# Altium schematic sheet Microcontroller.SchDoc: Microcontroller
size Letter; Date: 2017-02-04; DocumentNumber: 10; Revision: A; SheetNumber: 10; SheetTotal: 16; DesignedBy: Craig Comberbach
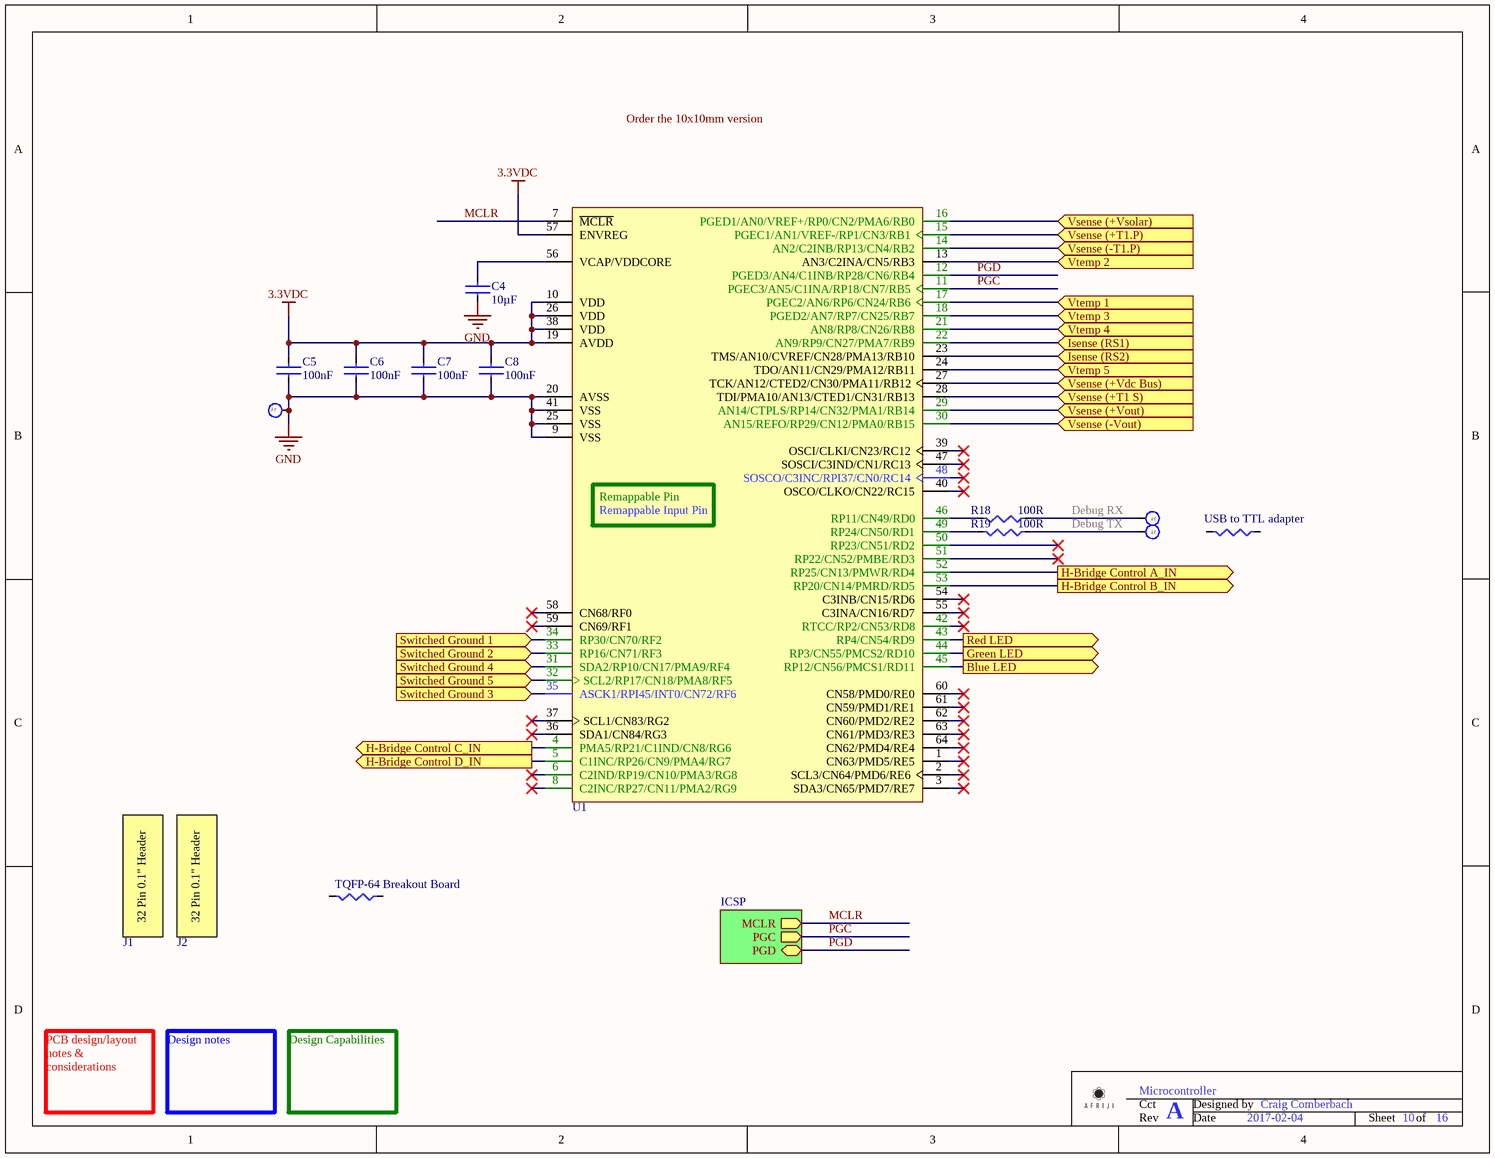
[diagram p0: Microcontroller.SchDoc]

## Parts
C4  Capacitance: 10µF  [C0805 - Ceramic]  (hidden comment: 10uF 0805 10V)
C5  Capacitance: 100nF  [C0603 - Ceramic]  (hidden comment: 100nF 0603 50V)
C6  Capacitance: 100nF  [C0603 - Ceramic]  (hidden comment: 100nF 0603 50V)
C7  Capacitance: 100nF  [C0603 - Ceramic]  (hidden comment: 100nF 0603 50V)
C8  Capacitance: 100nF  [C0603 - Ceramic]  (hidden comment: 100nF 0603 50V)
J1  32-Pin 0.1" Header  (value not drawn)  (mechanical)
J2  32-Pin 0.1" Header  (value not drawn)  (mechanical)
R18  Resistance (Ohms): 100R  [R0603]  (hidden comment: 100R 0603 1%)
R19  Resistance (Ohms): 100R  [R0603]  (hidden comment: 100R 0603 1%)
TP1  Test Clip  [SMT Test Clip]  (value not drawn)
TP2  Test Clip  [SMT Test Clip]  (value not drawn)
TP3  Test Clip  [SMT Test Clip]  (value not drawn)
TQFP-64_Breakout_Board  1k 1210 1%  (value not drawn)  (mechanical)
U1  PIC24FJ256GA106 Microprocessor  [TQFP-64 0.5mm Breakout Board]  (value not drawn)
USB_to_TTL_Serial_3.3V  USB to TTL adapter  (mechanical)

## Sub-sheets
ICSP = ICSP.SchDoc: MCLR (out), PGD (bidir), PGC (out)

## Ports
Blue LED (out), Green LED (out), H-Bridge Control A_IN (out), H-Bridge Control B_IN (out), H-Bridge Control C_IN (out), H-Bridge Control D_IN (out), Isense (RS1) (in), Isense (RS2) (in), Red LED (out), Switched Ground 1 (in), Switched Ground 2 (in), Switched Ground 3 (in), Switched Ground 4 (in), Switched Ground 5 (in), Vsense (+T1 S) (in), Vsense (+T1.P) (in), Vsense (+Vdc Bus) (in), Vsense (+Vout) (in), Vsense (+Vsolar) (in), Vsense (-T1.P) (in), Vsense (-Vout) (in), Vtemp 1 (in), Vtemp 2 (in), Vtemp 3 (in), Vtemp 4 (in), Vtemp 5 (in)

## Nets
3.3VDC: C5.1 C6.1 C7.1 C8.1 U1.10(VDD) U1.19(AVDD) U1.26(VDD) U1.38(VDD) U1.57(ENVREG)
GND: C4.2 C5.2 C6.2 C7.2 C8.2 TP1.1 U1.9(VSS) U1.20(AVSS) U1.25(VSS) U1.41(VSS)
Blue LED: U1.45(RP12/CN56/PMCS1/RD11) ; port Blue LED
Debug RX: R18.2 TP2.1
Debug TX: R19.2 TP3.1
Green LED: U1.44(RP3/CN55/PMCS2/RD10) ; port Green LED
H-Bridge Control A_IN: U1.52(RP25/CN13/PMWR/RD4) ; port H-Bridge Control A_IN
H-Bridge Control B_IN: U1.53(RP20/CN14/PMRD/RD5) ; port H-Bridge Control B_IN
H-Bridge Control C_IN: U1.4(PMA5/RP21/C1IND/CN8/RG6) ; port H-Bridge Control C_IN
H-Bridge Control D_IN: U1.5(C1INC/RP26/CN9/PMA4/RG7) ; port H-Bridge Control D_IN
Isense (RS1): U1.22(AN9/RP9/CN27/PMA7/RB9) ; port Isense (RS1)
Isense (RS2): U1.23(TMS/AN10/CVREF/CN28/PMA13/RB10) ; port Isense (RS2)
MCLR: U1.7(~{MCLR}) ; sheet ICSP/MCLR
PGC: U1.11(PGEC3/AN5/C1INA/RP18/CN7/RB5) ; sheet ICSP/PGC
PGD: U1.12(PGED3/AN4/C1INB/RP28/CN6/RB4) ; sheet ICSP/PGD
Red LED: U1.43(RP4/CN54/RD9) ; port Red LED
Switched Ground 1: U1.34(RP30/CN70/RF2) ; port Switched Ground 1
Switched Ground 2: U1.33(RP16/CN71/RF3) ; port Switched Ground 2
Switched Ground 3: U1.35(ASCK1/RPI45/INT0/CN72/RF6) ; port Switched Ground 3
Switched Ground 4: U1.31(SDA2/RP10/CN17/PMA9/RF4) ; port Switched Ground 4
Switched Ground 5: U1.32(SCL2/RP17/CN18/PMA8/RF5) ; port Switched Ground 5
Vsense (+T1 S): U1.28(TDI/PMA10/AN13/CTED1/CN31/RB13) ; port Vsense (+T1 S)
Vsense (+T1.P): U1.15(PGEC1/AN1/VREF-/RP1/CN3/RB1) ; port Vsense (+T1.P)
Vsense (+Vdc Bus): U1.27(TCK/AN12/CTED2/CN30/PMA11/RB12) ; port Vsense (+Vdc Bus)
Vsense (+Vout): U1.29(AN14/CTPLS/RP14/CN32/PMA1/RB14) ; port Vsense (+Vout)
Vsense (+Vsolar): U1.16(PGED1/AN0/VREF+/RP0/CN2/PMA6/RB0) ; port Vsense (+Vsolar)
Vsense (-T1.P): U1.14(AN2/C2INB/RP13/CN4/RB2) ; port Vsense (-T1.P)
Vsense (-Vout): U1.30(AN15/REFO/RP29/CN12/PMA0/RB15) ; port Vsense (-Vout)
Vtemp 1: U1.17(PGEC2/AN6/RP6/CN24/RB6) ; port Vtemp 1
Vtemp 2: U1.13(AN3/C2INA/CN5/RB3) ; port Vtemp 2
Vtemp 3: U1.18(PGED2/AN7/RP7/CN25/RB7) ; port Vtemp 3
Vtemp 4: U1.21(AN8/RP8/CN26/RB8) ; port Vtemp 4
Vtemp 5: U1.24(TDO/AN11/CN29/PMA12/RB11) ; port Vtemp 5
NetC4_1: C4.1 U1.56(VCAP/VDDCORE)
NetR18_1: R18.1 U1.46(RP11/CN49/RD0)
NetR19_1: R19.1 U1.49(RP24/CN50/RD1)

Not connected (* = marked no-connect by the designer): TQFP-64_Breakout_Board 1 2; U1 1(CN63/PMD5/RE5)* 2(SCL3/CN64/PMD6/RE6)* 3(SDA3/CN65/PMD7/RE7)* 6(C2IND/RP19/CN10/PMA3/RG8)* 8(C2INC/RP27/CN11/PMA2/RG9)* 36(SDA1/CN84/RG3)* 37(SCL1/CN83/RG2)* 39(OSCI/CLKI/CN23/RC12)* 40(OSCO/CLKO/CN22/RC15)* 42(RTCC/RP2/CN53/RD8)* 47(SOSCI/C3IND/CN1/RC13)* 48(SOSCO/C3INC/RPI37/CN0/RC14)* 50(RP23/CN51/RD2)* 51(RP22/CN52/PMBE/RD3)* 54(C3INB/CN15/RD6)* 55(C3INA/CN16/RD7)* 58(CN68/RF0)* 59(CN69/RF1)* 60(CN58/PMD0/RE0)* 61(CN59/PMD1/RE1)* 62(CN60/PMD2/RE2)* 63(CN61/PMD3/RE3)* 64(CN62/PMD4/RE4)*; USB_to_TTL_Serial_3.3V 1 2

## Notes on the sheet
- PCB design/layout notes & considerations
- Design notes
- Design Capabilities
- Cct
- Designed by
- Rev
- Date
- Sheet
- of
- Labels drawn without touching a wire or pin: Order the 10x10mm version
- (in symbol 32-Pin 0.1" Header) 32 Pin 0.1" Header
- (in symbol PIC24FJ256GA106 Microprocessor) Remappable Pin; Remappable Input Pin
- (in symbol Test Clip) Clip; Test

## Library data of the parts
C4 = 10uF 0805 10V: Manufacturer: Kemet; Manufacturer Part Number: C0805C106K8PACTU; Tolerance: ±10%; Temperature Coefficient: X5R; Value: 10uF 0805 10V; Supplier 1: Digi-Key; RoHS: RoHS Compliant; Category: Capacitors; Stock 1: 215894; Pricing 1: 1=0.21, 10=0.14, 50=0.085, 100=0.0714, 250=0.0578, 500=0.051, 1000=0.04335 (USD); Packaging: Cut Tape (CT); Voltage - Rated: 10V; Mounting Type: Surface Mount, MLCC; Operating Temperature: -55°C ~ 85°C; Applications: General Purpose; Ratings: -; Package / Case: 0805 (2012 Metric); Size / Dimension: 0.079" L x 0.049" W (2.00mm x 1.25mm); Height - Seated (Max): -; Thickness (Max): 0.055" (1.40mm); Lead Spacing: -; Features: -; Lead Style: -; ComponentLink1URL: http://www.kemet.com/docfinder?Partnumber=C0805C106K8PACTU; ComponentLink1Description: Spec Sheet; Supplier Part Number 1: 399-4925-1-ND
C5-C8 = 100nF 0603 50V: Manufacturer: Samsung Electro-Mechanics America, Inc; Manufacturer Part Number: CL10B104KB8SFNC; Tolerance: ±10%; Temperature Coefficient: X7R; Value: 100nF 0603 50V; Supplier 1: Digi-Key; RoHS: RoHS Compliant; Category: Capacitors; Stock 1: 1192070; Pricing 1: 1=0.1, 10=0.027, 25=0.0192, 100=0.0125, 500=0.00874, 1000=0.00681 (USD); Packaging: Cut Tape (CT); Voltage - Rated: 50V; Mounting Type: Surface Mount, MLCC; Operating Temperature: -55°C ~ 125°C; Applications: Boardflex Sensitive; Ratings: -; Package / Case: 0603 (1608 Metric); Size / Dimension: 0.063" L x 0.031" W (1.60mm x 0.80mm); Height - Seated (Max): -; Thickness (Max): 0.035" (0.90mm); Lead Spacing: -; Features: Soft Termination; Lead Style: -; ComponentLink1URL: http://www.samsungsem.com/kr/front/downloadcms.do?path=/kr/support/product-search/mlcc/__icsFiles/afieldfile/2014/11/05&fileName=S_CL10B104KB8SFNC.pdf; ComponentLink1Description: Spec Sheet; Supplier Part Number 1: 1276-1936-1-ND
J1 J2 = 32-Pin 0.1" Header: Manufacturer: Wurth Electronics Inc; Manufacturer Part Number: 61303211821; Style: Board to Board; Number of Positions: 32; Number of Positions Loaded: All; Pitch - Mating: 0.100" (2.54mm); Contact Length - Post: 0.122" (3.10mm); Material Flammability Rating: UL94 V-0; Current Rating: 3A; Voltage Rating: 250VAC; Supplier 1: Digi-Key; RoHS: RoHS Compliant; Category: Connectors, Interconnects; Stock 1: 332; Pricing 1: 1=1.86, 10=1.788, 50=1.65, 100=1.5125, 500=1.375 (USD); Packaging: Tray; Part Status: Active; Connector Type: Header; Contact Type: Forked; Number of Rows: 1; Row Spacing - Mating: -; Mounting Type: Through Hole; Termination: Solder; Fastening Type: Push-Pull; Contact Finish - Mating: Gold; Contact Finish Thickness - Mating: -; Insulation Color: Black; Insulation Height: 0.335" (8.51mm); Operating Temperature: -40°C ~ 105°C; Contact Finish - Post: Gold; Mated Stacking Heights: -; Ingress Protection: -; Features: -; Applications: -; Insulation Material: Polybutylene Terephthalate (PBT); Contact Shape: Square; Contact Material: Copper Alloy; Contact Finish Thickness - Post: -; ComponentLink1URL: http://katalog.we-online.de/em/datasheet/6130xx11821.pdf; ComponentLink1Description: Spec Sheet; Supplier Part Number 1: 732-2860-ND
R18 R19 = 100R 0603 1%: 1/8W; Manufacturer: Yageo; Manufacturer Part Number: RC0603FR-07100RL; Power (Watts): 0.1W, 1/10W; Temperature Coefficient: ±100ppm/°C; Value: 100R 0603 1%; Supplier 1: Digi-Key; RoHS: RoHS Compliant; Category: Resistors; Stock 1: 2116183; Pricing 1: 1=0.1, 10=0.015, 25=0.0108, 100=0.006, 250=0.00456, 500=0.00364, 1000=0.00268, 2500=0.00233 (USD); Packaging: Cut Tape (CT); Tolerance: ±1%; Composition: Thick Film; Features: Moisture Resistant; Operating Temperature: -55°C ~ 155°C; Package / Case: 0603 (1608 Metric); Supplier Device Package: 0603; Size / Dimension: 0.063" L x 0.031" W (1.60mm x 0.80mm); Height: 0.022" (0.55mm); Number of Terminations: 2; ComponentLink1URL: http://www.yageo.com/NewPortal/yageodocoutput?fileName=/pdf/R-Chip/PYu-RC_Group_51_RoHS_L_0.pdf; ComponentLink1Description: http://www.yageo.com/NewPortal/yageodocoutput?fileName=/pdf/R-Chip/PYu-RC_Group_51_RoHS_L_0.pdf; Supplier Part Number 1: 311-100HRCT-ND
TP1-TP3 = Test Clip: Manufacturer: TE Connectivity AMP Connectors; Manufacturer Part Number: RCU-0C; Value: SMT Test Clip; Material - Insulation: No Insulation; Technology: SMT; Supplier 1: Digi-Key; RoHS: RoHS Compliant; Category: Test and Measurement; Stock 1: 58926; Pricing 1: 1=0.31, 10=0.291, 25=0.248, 50=0.217, 100=0.2014, 250=0.1782, 500=0.17046, 1000=0.13947 (CAD); Packaging: Cut Tape (CT); Part Status: Active; Type: PC Test Point; Mounting Type: Surface Mount; Color: Natural; Size / Dimension: 0.063" x 0.031" x 0.045" (1.60mm x 0.80mm x 1.15mm); Plating: -; Material - Body: -; ComponentLink1URL: http://www.te.com/commerce/DocumentDelivery/DDEController?Action=srchrtrv&DocNm=1773266&DocType=DS&DocLang=English; ComponentLink1Description: Spec Sheet; Supplier Part Number 1: A106145CT-ND
TQFP-64_Breakout_Board = 1k 1210 1%: 1/8W; Manufacturer: Chip Quik Inc.; Manufacturer Part Number: PA0096; Value: TQFP-64 Breakout Board; Proto Board Type: SMD to DIP; Package Accepted: LQFP, TQFP, VQFP; Number of Positions: 64; Pitch: 0.020" (0.50mm); Board Thickness: 0.062" (1.57mm) 1/16"; Supplier 1: Digi-Key; Supplier Part Number 1: PA0096-ND; RoHS: RoHS Compliant; Category: Prototyping Products; Stock 1: 56; Pricing 1: 1=15.79 (USD); Part Status: Active; Hole Diameter: -; Material: FR4 Epoxy Glass; Size / Dimension: 1.000" x 3.200" (25.40mm x 81.28mm); ComponentLink1URL: http://www.chipquik.com/datasheets/PA0096.pdf; ComponentLink1Description: Spec Sheet
U1 = PIC24FJ256GA106 Microprocessor: General Purpose 16-Bit Flash Microcontroller, 256KB Flash, 16KB SRAM, 64-Pin TQFP, Industrial Temperature; Manufacturer: Microchip Technology; Manufacturer Part Number: PIC24FJ256GA106-I/PT; Core Processor: PIC; Speed: 32MHz; Connectivity: I²C, PMP, SPI, UART/USART; Peripherals: Brown-out Detect/Reset, LVD, POR, PWM, WDT; Number of I/O: 53; Program Memory Size: 256KB (85.5K x 24); RAM Size: 16K x 8; Voltage - Supply (Vcc/Vdd): 2 V ~ 3.6 V; Data Converters: A/D 16x10b; Oscillator Type: Internal; Value: PIC24FJ256GA106 Microprocessor; Technology: SMT; Supplier 1: Digi-Key; Supplier Part Number 1: PIC24FJ256GA106-I/PT-ND; RoHS: RoHS Compliant; Category: Integrated Circuits (ICs); Stock 1: 6379; Pricing 1: 1=7.45, 10=6.201, 25=5.6864, 100=5.1477 (CAD); Packaging: Tray; Core Size: 16-Bit; Program Memory Type: FLASH; EEPROM Size: -; Operating Temperature: -40°C ~ 85°C; Package / Case: 64-TQFP; Supplier Device Package: 64-TQFP (10x10); ComponentLink1URL: http://www.microchip.com/mymicrochip/filehandler.aspx?ddocname=en534317; ComponentLink1Description: Spec Sheet
USB_to_TTL_Serial_3.3V = 1k 1210 1%: 1/8W; Manufacturer: FTDI, Future Technology Devices International Ltd; Manufacturer Part Number: TTL-232RG-VSW3V3-WE; Usage: USB to TTL Serial 3.3V; Convert From (Adapter End): USB - A, Plug; Convert To (Adapter End): Cable, 6 Wire Leads; Shielding: Unshielded; Supplier 1: Digi-Key; Supplier Part Number 1: 768-1072-ND; RoHS: RoHS Compliant; Category: Cable Assemblies; Stock 1: 1142; Pricing 1: 1=21.07, 10=18.32, 50=16.66, 100=16.2501, 250=15.48008 (USD); Part Status: Active; Length: 5.90' (1.80m); ComponentLink1URL: http://www.ftdichip.com/Support/Documents/DataSheets/Cables/DS_TTL-232RG_CABLES.pdf; ComponentLink1Description: http://www.ftdichip.com/Support/Documents/DataSheets/Cables/DS_TTL-232RG_CABLES.pdf